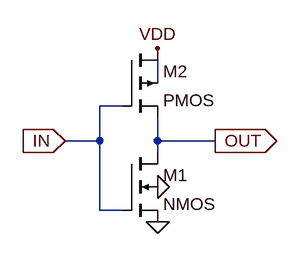
[diagram p0: schematic INVERTOR.asc]
INVERTOR.asc, the LTspice schematic file:
Version 4
SHEET 1 880 680
WIRE 240 80 240 48
WIRE 192 112 160 112
WIRE 160 160 160 112
WIRE 160 160 112 160
WIRE 240 160 240 128
WIRE 320 160 240 160
WIRE 240 176 240 160
WIRE 160 256 160 160
WIRE 192 256 160 256
FLAG 112 160 IN
IOPIN 112 160 In
FLAG 320 160 OUT
IOPIN 320 160 Out
FLAG 240 272 0
FLAG 240 224 0
FLAG 240 32 VDD
SYMBOL nmos4 192 176 R0
SYMATTR InstName M1
SYMATTR Value2 l=90n w=200n
SYMBOL pmos4 192 32 R0
SYMATTR InstName M2
SYMATTR Value2 l=90n w=400n

The netlist it stands for:
* INVERTOR.asc
M1 OUT IN 0 0 NMOS l=90n w=200n
M2 VDD IN OUT N001 PMOS l=90n w=400n
.model NMOS NMOS
.model PMOS PMOS
.lib standard.mos
.backanno
.end